# EAGLE design Wifi_Modem_PET-Adapter (EAGLE 9.6.2)
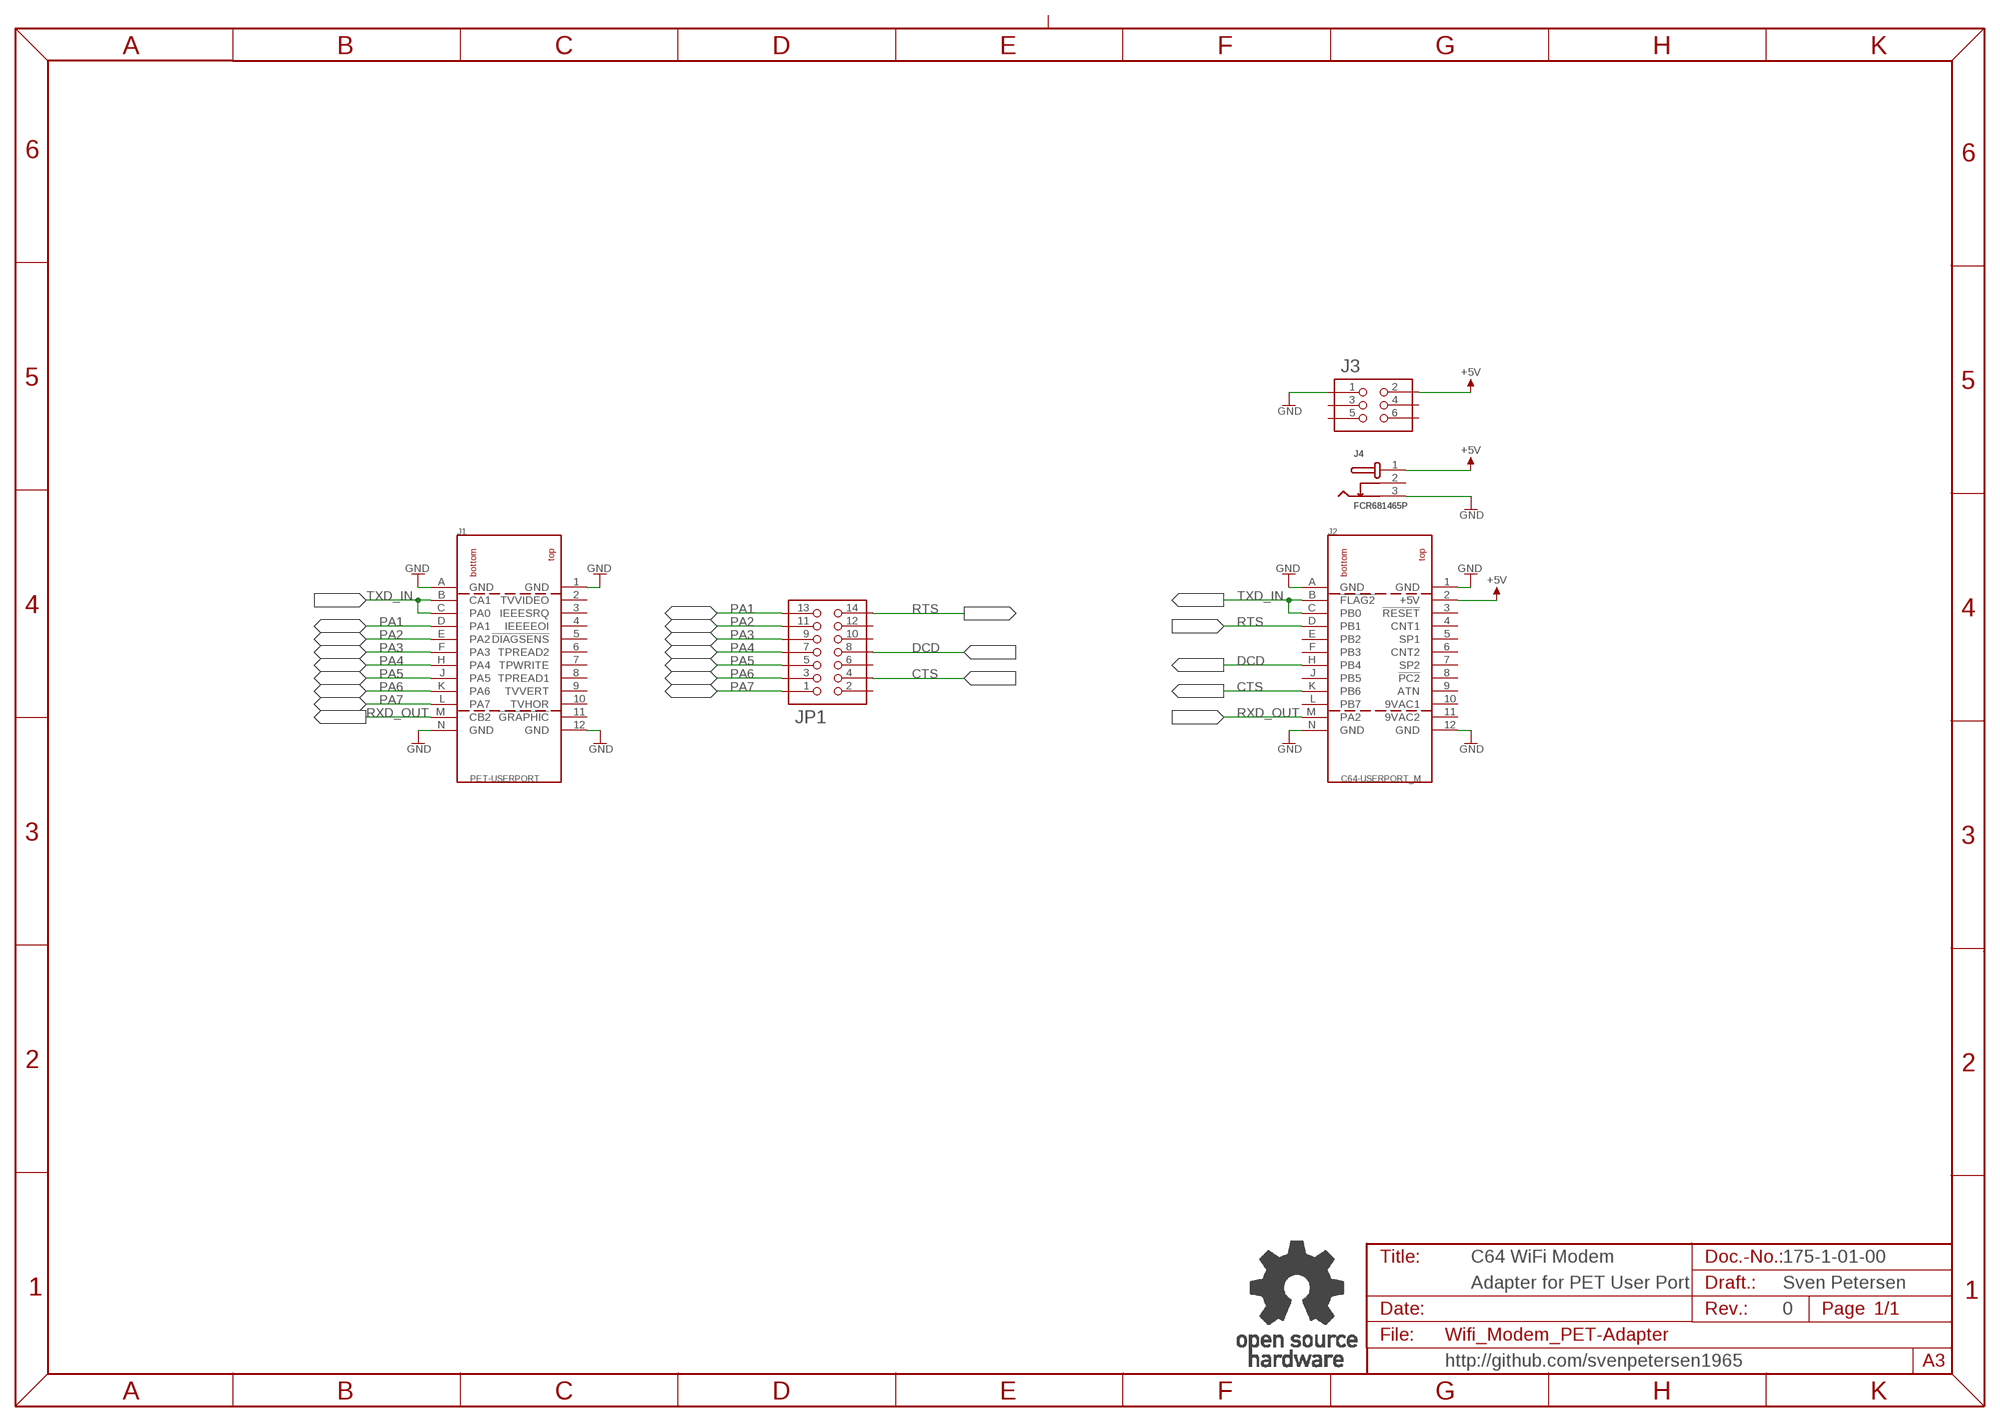
[diagram p0: schematic, sheet 1]

## Parts
J1  PET-USERPORT  [USERPORT]
J2  C64-USERPORT_M  [USERPORT_M]
J3  2X03WV  [2X03WV]
J4  FCR681465P  [FCR681465P]
JP1  PINHD-2X7  [2X07]
U$2  OPEN_SOURCE_HW  [OPENHW]

## Nets
+5V: J2.2(+5V) J3.2 J4.1
CTS: J2.K(PB6) JP1.4
DCD: J2.H(PB4) JP1.8
GND: J1.1(GND) J1.12(GND) J1.A(GND) J1.N(GND) J2.1(GND) J2.12(GND) J2.A(GND) J2.N(GND) J3.1 J4.3
PA1: J1.D(PA1) JP1.13
PA2: J1.E(PA2) JP1.11
PA3: J1.F(PA3) JP1.9
PA4: J1.H(PA4) JP1.7
PA5: J1.J(PA5) JP1.5
PA6: J1.K(PA6) JP1.3
PA7: J1.L(PA7) JP1.1
RTS: J2.D(PB1) JP1.14
RXD_OUT: J1.M(CB2) J2.M(PA2)
TXD_IN: J1.B(CA1) J1.C(PA0) J2.B(!FLAG2) J2.C(PB0)
Unconnected: J1.2(TVVIDEO) J1.3(IEEESRQ) J1.4(IEEEEOI) J1.5(!DIAGSENS) J1.6(TPREAD2) J1.7(TPWRITE) J1.8(TPREAD1) J1.9(TVVERT) J1.10(TVHOR) J1.11(!GRAPHIC) J2.3(!RESET) J2.4(CNT1) J2.5(SP1) J2.6(CNT2) J2.7(SP2) J2.8(!PC2) J2.9(ATN) J2.E(PB2) J2.F(PB3) J2.J(PB5) J2.L(PB7) J3.3 J3.4 J3.5 J3.6 J4.2 JP1.2 JP1.6 JP1.10 JP1.12

## Notes on the sheet
- C64 WiFi Modem | 175-1-01-00
- Adapter for PET User Port | Sven Petersen
- 0
- http://github.com/svenpetersen1965

## Power pins joined to a net without a drawn wire
9VAC1: J2.10(9VAC1)
9VAC2: J2.11(9VAC2)

## Library data of the parts
J1 = Commodore:PET-USERPORT
J2 = Commodore:C64-USERPORT
J3 = PINHEAD:2X03WV
J4 = Cliff:FCR681465P
JP1 = PINHEAD:PINHD-2X7
U$2 = Logo:OPEN_SOURCE_HW

## Board
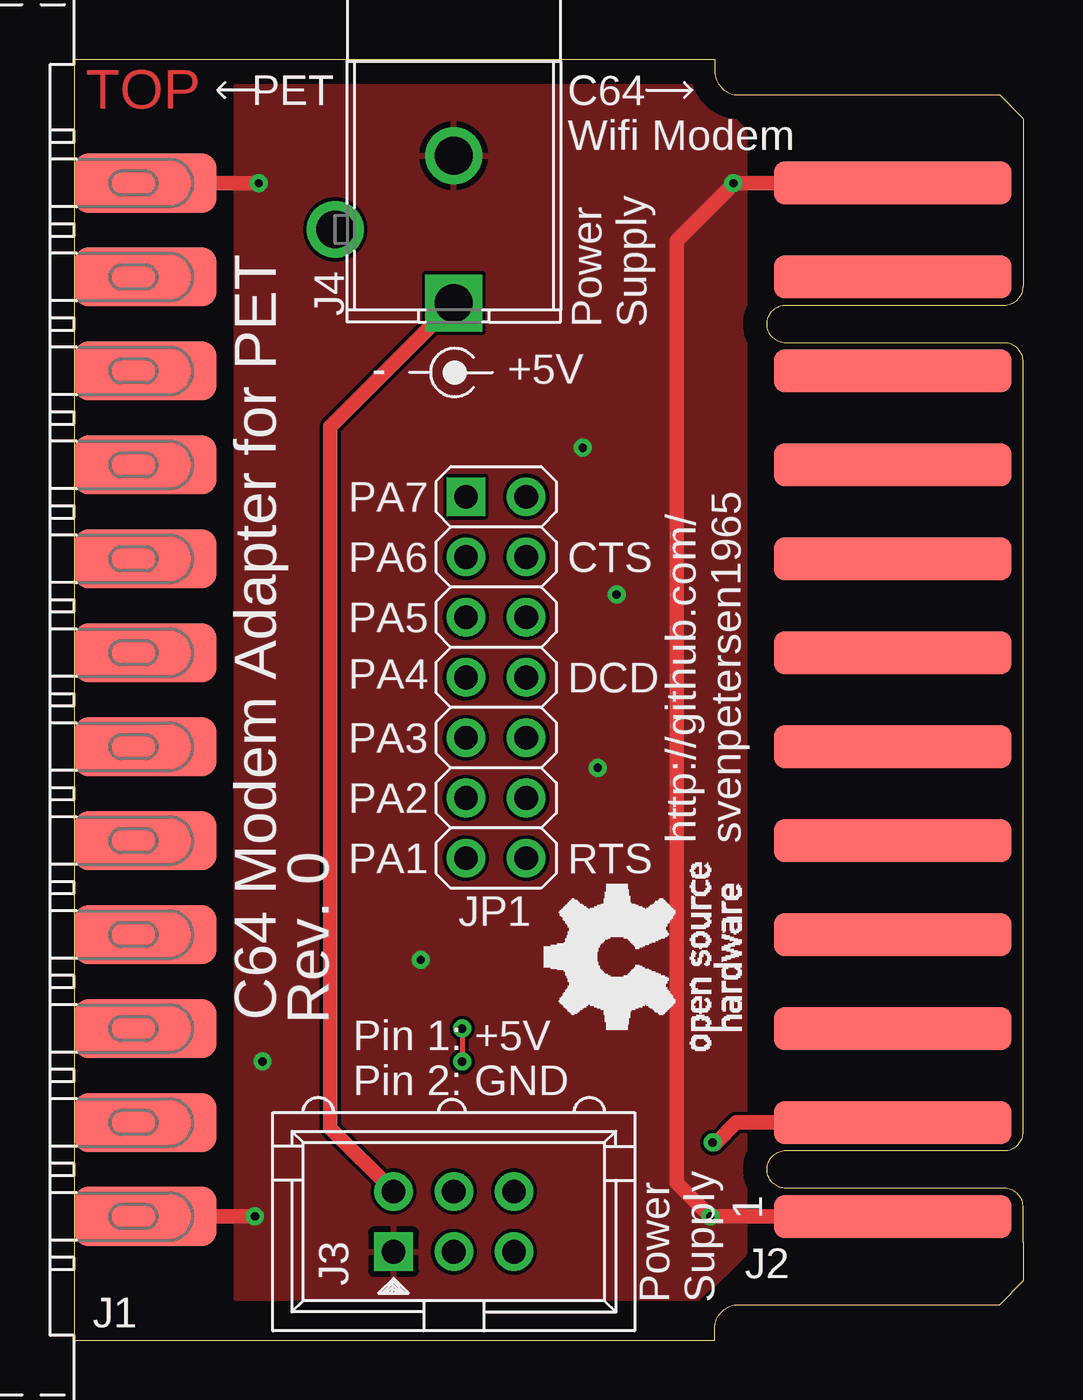
[diagram p1: board, top side]
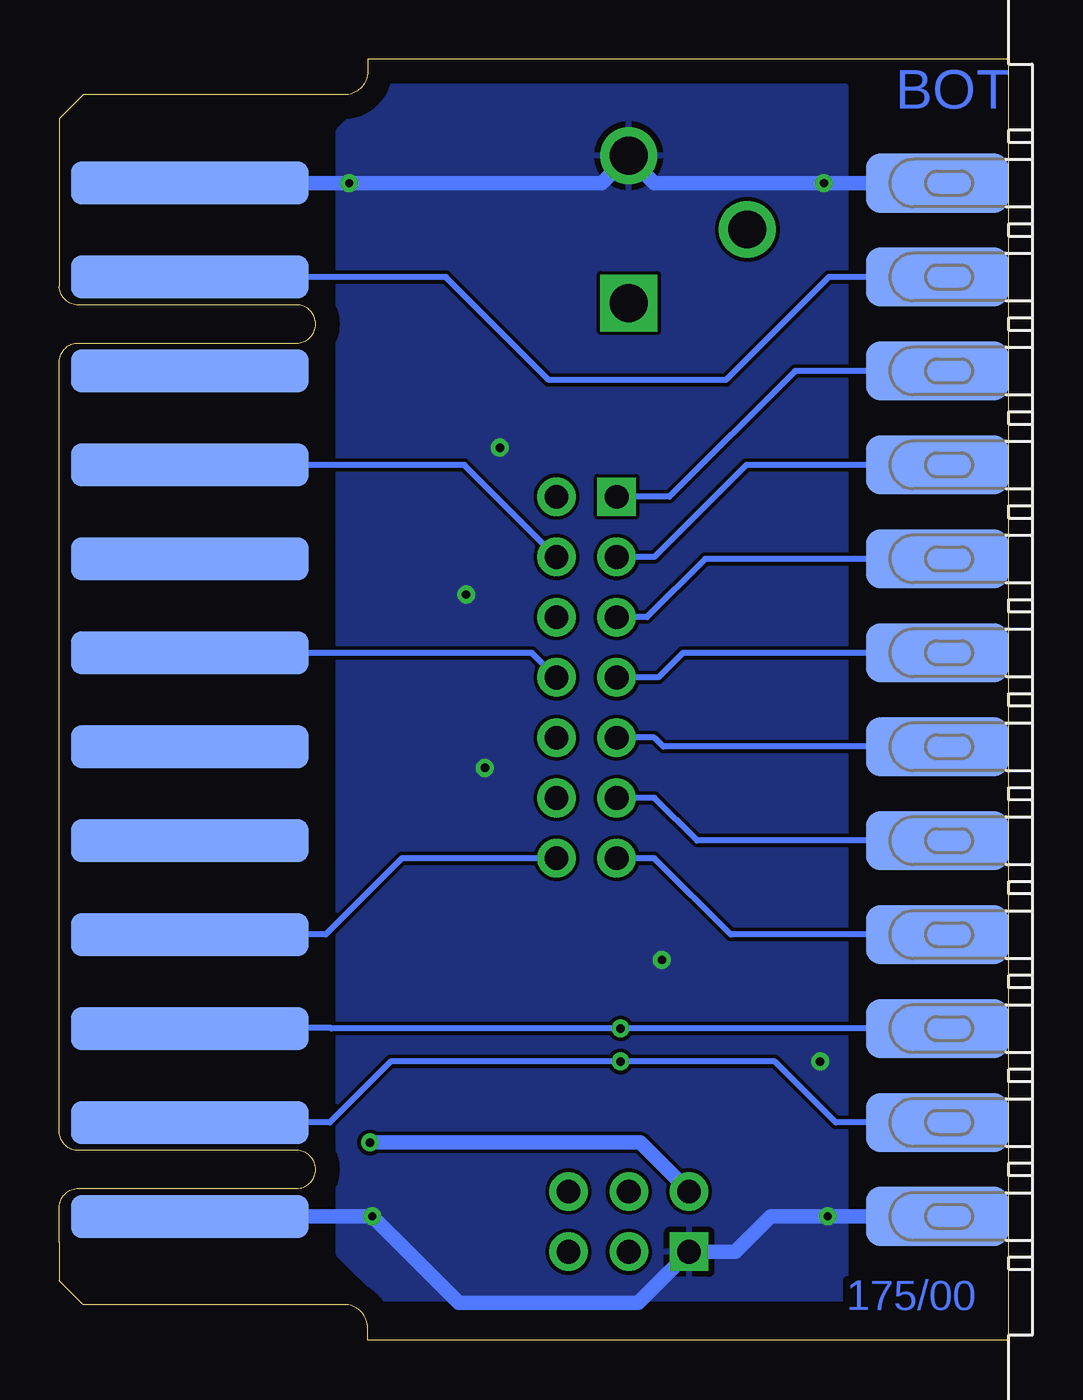
[diagram p2: board, bottom side, seen from below]

Size 40 x 54 mm. Coordinates in mm from the lower left corner, seen from the top.
Outline: 28,1.5 arc90 27,0.5 27,0 0,0 0,54 27,54 27,53.5 arc90 28,52.5
Copper layers (1*16): Top 0.035mm / dielectric 1.5mm / Bottom 0.035mm
Design rules "default *": minimum track width 6mil, minimum drill 0.35mm, track to track 6mil, track to pad 6mil, pad to pad 6mil, via to via 6mil, smd to smd 6mil, copper to edge 40mil, drill to drill 6mil, minimum pad ring 10mil, minimum via ring 8mil, stop-mask expansion 4mil, vias tented up to drill 25mil, thermal gap 10mil

### Footprints (pad centres in the part's own frame; a part is rotated, then mirrored left to right if it is on the bottom)
USERPORT = smd 2.5 x 6: 1 -21.78,-3; 2 -17.82,-3; 3 -13.86,-3; 4 -9.9,-3; 5 -5.94,-3; 6 -1.98,-3; 7 1.98,-3; 8 5.94,-3; 9 9.9,-3; 10 13.86,-3; 11 17.82,-3; 12 21.78,-3 | smd 2.5 x 6 bottom: A -21.78,-3; B -17.82,-3; C -13.86,-3; D -9.9,-3; E -5.94,-3; F -1.98,-3; H 1.98,-3; J 5.94,-3; K 9.9,-3; L 13.86,-3; M 17.82,-3; N 21.78,-3
USERPORT_M = smd 1.8 x 10: 1 -21.78,5.5; 2 -17.82,5.5; 3 -13.86,5.5; 4 -9.9,5.5; 5 -5.94,5.5; 6 -1.98,5.5; 7 1.98,5.5; 8 5.94,5.5; 9 9.9,5.5; 10 13.86,5.5; 11 17.82,5.5; 12 21.78,5.5 | smd 1.8 x 10 bottom: A -21.78,5.5; B -17.82,5.5; C -13.86,5.5; D -9.9,5.5; E -5.94,5.5; F -1.98,5.5; H 1.98,5.5; J 5.94,5.5; K 9.9,5.5; L 13.86,5.5; M 17.82,5.5; N 21.78,5.5
2X03WV = drill 1 pad 1.626 square: 1 -2.54,-1.27 | drill 1 pad 1.626: 2 -2.54,1.27; 3 0,-1.27; 4 0,1.27; 5 2.54,-1.27; 6 2.54,1.27
FCR681465P = drill 1.6 square: 1 0,13.7 | drill 1.6: 2 5,10.6; 3 0,7.5
2X07 = drill 1 pad 1.626 square: 1 -7.62,-1.27 | drill 1 pad 1.626: 2 -7.62,1.27; 3 -5.08,-1.27; 4 -5.08,1.27; 5 -2.54,-1.27; 6 -2.54,1.27; 7 0,-1.27; 8 0,1.27; 9 2.54,-1.27; 10 2.54,1.27; 11 5.08,-1.27; 12 5.08,1.27; 13 7.62,-1.27; 14 7.62,1.27

### Placement (x,y rotation side)
J1  0,27 90 top
J2  40,27 90 top
J3  16,5 0 top
J4  16,57.43 180 top
JP1  17.78,27.94 270 top
U$2  28.1,12.22 90 top
U$40  [2LAYER]  0.48,51.91 0 top
U$41  [PCB-TITLE/]  0,68.58 0 top  (outside the outline)

### Tracks (layer width: path | path; a pad name or v marks a point on that pad's centre or on a via)
+5V  (via drill 0.35)
  Top 0.61: J4.1 10.79,38.52 10.79,8.94 J3.2 | J2.2 27.91,9.18 26.99,8.26 v26.91,8.33
  Bottom 0.61: v26.91,8.33 15.52,8.33 J3.2
CTS
  Bottom 0.254: JP1.4 22.93,36.9 J2.K
DCD
  Bottom 0.254: JP1.8 20.09,28.98 J2.H
GND  (via drill 0.35)
  Top 0.61: J1.12 7.74,48.78 7.78,48.74 v7.78,48.78 | J2.12 27.82,48.78 27.78,48.74 | 27.78,48.74 v27.78,48.78 | J2.A 26.85,5.22 | J1.1 7.6,5.22 7.62,5.24 v7.62,5.22 | v26.81,5.22 25.4,6.63 25.4,46.35 27.78,48.74
  Bottom 0.61: J1.12 v7.78,48.78 14.92,48.78 16.03,49.89 | 16.03,49.89 17.14,48.78 v27.78,48.78 J2.12 | J1.1 v7.62,5.22 10.02,5.22 11.51,3.73 J3.1 15.6,1.59 19.68,1.59 23.18,1.59 v26.81,5.22 J2.A | 16.03,49.89 16.03,49.9 J4.3
  other vias: 7.94,11.75 14.61,16.03 22.07,24.13 22.86,31.43 21.43,37.62
  pour Bottom: 6.83,52.86 26.35,52.86 28.26,50.96 28.26,3.65 26.35,1.75 6.83,1.75
  pour Top: 6.83,52.86 26.35,52.86 28.26,50.96 28.26,3.65 26.35,1.75 6.83,1.75
PA1
  Bottom 0.254: J1.D 11.7,17.1 14.92,20.32 JP1.13
PA2
  Bottom 0.254: J1.E 13.12,21.06 14.92,22.86 JP1.11
PA3
  Bottom 0.254: J1.F 14.54,25.02 14.92,25.4 JP1.9
PA4
  Bottom 0.254: J1.H 13.72,28.98 14.76,27.94 JP1.7
PA5
  Bottom 0.254: J1.J 12.78,32.94 15.24,30.48 JP1.5
PA6
  Bottom 0.254: J1.K 11.04,36.9 14.92,33.02 JP1.3
PA7
  Bottom 0.254: J1.L 8.99,40.86 14.29,35.56 JP1.1
RTS
  Bottom 0.254: JP1.14 25.56,20.32 28.78,17.1 J2.D
RXD_OUT
  Bottom 0.254: J1.M 7.57,44.82 11.91,40.48 19.37,40.48 23.71,44.82 J2.M
TXD_IN  (via drill 0.35)
  Top 0.203: v16.35,13.14 v16.35,11.75
  Bottom 0.254: J1.C v16.35,13.14 28.54,13.14 28.57,13.18 34.46,13.18 J2.C | J1.B 7.28,9.18 9.84,11.75 v16.35,11.75 26.04,11.75 28.6,9.18 J2.B

### Text on the board
Bottom: 175/00
tNames: PET | C64 / Wifi Modem | Power / Supply | - | +5V | PA7 | PA6 | CTS | PA5 | PA4 | DCD | PA3 | PA2 | http://github.com/ / svenpetersen1965 | PA1 | RTS | C64 Modem Adapter for PET | Rev. 0 | Pin 1: +5V / Pin 2: GND | Power / Supply
Measures: FCR681465P | experimental
Document: 175-2-01-00 | Sven Petersen / 2021 | 35µm | 2 | 0